# Altium schematic sheet reverse_polarity_protection.SchDoc
size A4; SheetNumber: 2; SheetTotal: 4
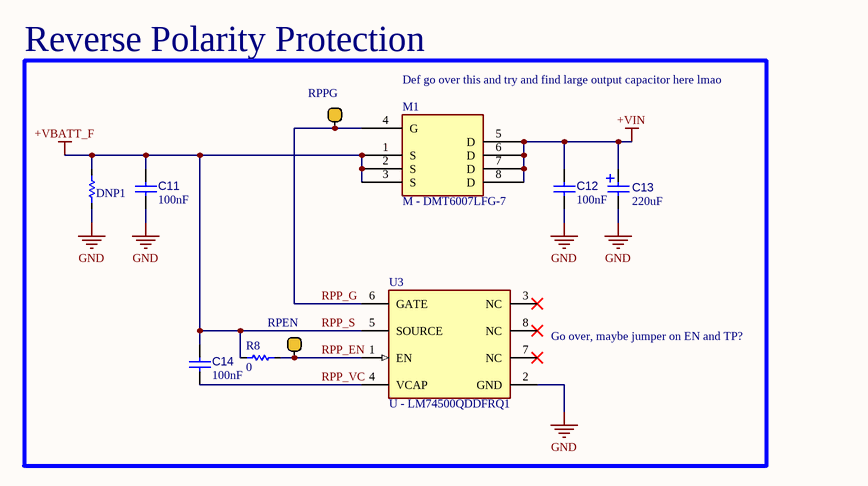
[diagram p0: reverse_polarity_protection.SchDoc]

## Parts
C11  value 100nF  [CAP_0603]  (hidden comment: C - CAP CER 100nF 100V 10% 0603)
C12  value 100nF  [CAP_0603]  (hidden comment: C - CAP CER 100nF 100V 10% 0603)
C13  value 220uF  [C - 860020574012]  (hidden comment: 860020574012)
C14  value 100nF  [CAP_0603]  (hidden comment: C - CAP CER 100nF 100V 10% 0603)
DNP1  DNP - DNP PAD 0603  [DNP 0603]  (value not drawn)
M1  M - DMT6007LFG-7  [M - DMT6007LFG-7]
R8  value 0  [RES 0603]  (hidden comment: R - RES 0R 0.1W N/A% 0603)
RPEN  TP - SMD Pad Testpoint-Symbol-1  [TP - SMD Pad Testpoint]  (value not drawn)
RPPG  TP - SMD Pad Testpoint-Symbol-1  [TP - SMD Pad Testpoint]  (value not drawn)
U3  U - LM74500QDDFRQ1  [U - LM74500QDDFRQ1]

## Nets
+VIN: C12.2 C13.1(POS) M1.5(D) M1.6(D) M1.7(D) M1.8(D)
GND: C11.1 C12.1 C13.2(NEG) DNP1.1 U3.2(GND)
RPP_S: C11.2 C14.2 DNP1.2 M1.1(S) M1.2(S) M1.3(S) R8.1 U3.5(SOURCE)  [also labelled +VBATT_F]
RPP_EN: R8.2 RPEN.1 U3.1(EN)
RPP_G: M1.4(G) RPPG.1 U3.6(GATE)
RPP_VC: C14.1 U3.4(VCAP)

Not connected (* = marked no-connect by the designer): U3 3(NC)* 7(NC)* 8(NC)*

## Notes on the sheet
- Reverse Polarity Protection
- (near M1) Def go over this and try and find large output capacitor here lmao
- (near U3) Go over, maybe jumper on EN and TP?

## Library data of the parts
C11 C12 C14 = C - CAP CER 100nF 100V 10% 0603: GRM188R72A104KA35D - 0.1 µF ±10% 100V Ceramic Capacitor X7R 0603 (1608 Metric); Parameter 2: *
C13 = C - CAP ELC 220uF 35V 20% CAN: 860020574012 - 220 µF 35 V Aluminum Electrolytic Capacitors Radial, Can 2000 Hrs @ 105°C; Parameter 2: *
M1 = M - DMT6007LFG-7: DMT6007LFG-7 - N-Channel 60 V 15A (Ta), 80A (Tc) 2.2W (Ta), 62.5W (Tc) Surface Mount POWERDI3333-8
R8 = R - RES 0R 0.1W N/A% 0603: ERJ-3GEY0R00V - 0 Ohms Jumper Chip Resistor 0603 (1608 Metric) Automotive AEC-Q200 Thick Film
RPEN RPPG = TP - SMD Pad Testpoint-Symbol-1: Testpoint used for debugging and testing. SMD Pad
U3 = U - LM74500QDDFRQ1: LM74500QDDFRQ1 - Battery Battery Protection IC TSOT-23-8